# Altium project 5V to 3.3V Regulator.PrjPcb
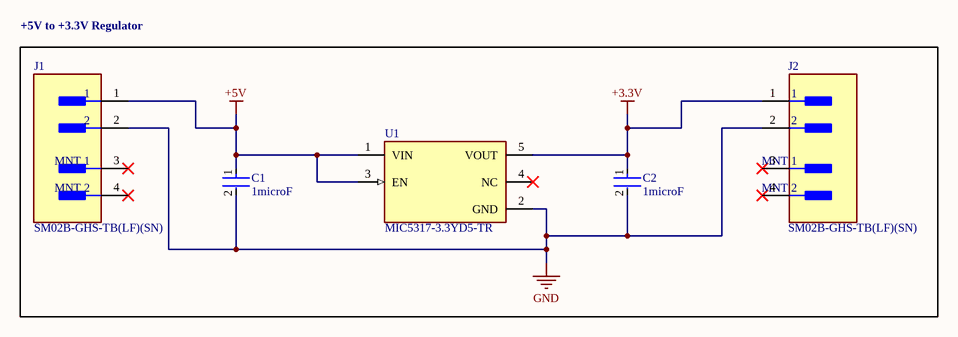
[diagram p0: Sheet2.SchDoc]
1 sheet, 5 parts. Net scope: global (net labels, ports and power ports of the same name join across sheets).
Board file: LDO-PCB.PcbDoc

## Sheet Sheet2.SchDoc
size A; SheetNumber: 1; SheetTotal: 1

### Parts
C1  1microF  [FP-CC0805-0_85-MFG]
C2  1microF  [FP-CC0805-0_85-MFG]
J1  SM02B-GHS-TB(LF)(SN)  [FP-SM02B-GHS-TB_LF_SN-MFG]
J2  SM02B-GHS-TB(LF)(SN)  [FP-SM02B-GHS-TB_LF_SN-MFG]
U1  MIC5317-3.3YD5-TR  [FP-C04-1179-MFG]

### Blocks framed on the sheet
+5V to +3.3V Regulator: C1 C2 J1 J2 U1

### Nets
+3.3V: C2.1 J2.1 U1.5(VOUT)
+5V: C1.1 J1.1 U1.1(VIN) U1.3(EN)
GND: C1.2 C2.2 J1.2 J2.2 U1.2(GND)

Not connected (* = marked no-connect by the designer): J1 3(MNT_1)* 4(MNT_2)*; J2 3(MNT_1)* 4(MNT_2)*; U1 4(NC)*

### Library data of the parts
C1 C2 = CMP-03422-000182-1: CAP CER 1UF 10V X7R 0805; Manufacturer: Yageo; Manufacturer Part Number: CC0805KKX7R6BB105; Material: Ceramic; Description: CC0805 1 uF X7R 10.00% 10 V; Tolerance: 0.1; Value: 1 uF; ComponentLink2URL: http://www.yageo.com/documents/recent/UPY-GPHC_Y5V_6.3V-to-50V_8.pdf; Automotive: No; Temperature Range Low: -30°C; Octopart: https://octopart.com/cc0805kkx7r6bb105-yageo-42522859; Temperature Characteristic: X7R; RoHS: TRUE; Voltage Rating: 10 V; Capacitance: 1 uF; Package: CC0805-0.85; Device Class L3: Ceramic Capacitors; Category: Cap; Mouser Description: Multilayer Ceramic Capacitors MLCC - SMD/SMT 1.0uF 10V X7R 10%; Temperature Range High: +85°C; Ipc Land Pattern Name: CAPC200125X85; ComponentLink2Description: Datasheet; Temperature: -30°C to +85°C; Height: 0.95mm; Lead Free: Yes; Device Class L1: Passive Components; Device Class L2: Capacitors; Footprint Url: http://www.yageo.com/exep/pages/download/literatures/UPY-C_GEN_24.pdf; Digikey Description: CAP CER 1UF 10V X7R 0805
J1 J2 = CMP-2000-07076-2: CONN HEADER SMD R/A 2POS 1.25MM; Voltage Rating: 50V; Number of Positions: 2; Pitch: 0.049inch; Current Rating: 1A; Connector Type: Outer Shroud Contact; Number of Rows: 1; Contact Material: Bronze; Termination: Solder; Color: Natural; Package Quantity: 2500; Mount: Surface Mount; Housing Color: Natural; Number of Contacts: 2; Packaging: Tape and Reel; Lead Free: Lead Free; Housing Material: Nylon; Orientation: Right Angle; Contact Type: Male Pin; Contact Plating: Tin; Series: GH; Fastening Type: Latch
U1 = CMP-00252-66802814-1: MIC5317-3.3YD5-TR LDO Regulator Pos 3.3V 0.15A 5-Pin TSOT-23 T/R; Accuracy: 3%; Output Current: 150mA; Max Junction Temperature (Tj): 150°C; Number of Regulators: 1; Min Input Voltage: 2.5V; Min Current Limit: 200mA; Power Supply Rejection Ratio (PSRR): 70dB; Dropout Voltage: 155mV; Min Supply Voltage: 4.3V; Max Input Voltage: 6V; Nominal Supply Current: 29µA; Max Operating Temperature: 125°C; Case/Package: SOT-23-5; Height: 1mm; Number of Outputs: 1; Lifecycle Status: Production; Schedule B: 8542390000, 8542390000; NexarPartId: 66802814; Output Voltage: 3.3V; Mount: Surface Mount; RoHS: Compliant; Min Operating Temperature: -40°C; Max Supply Voltage: 6V